# Altium schematic sheet FTDIJtagConversion.SchDoc
size A4; SheetNumber: 4; SheetTotal: 10
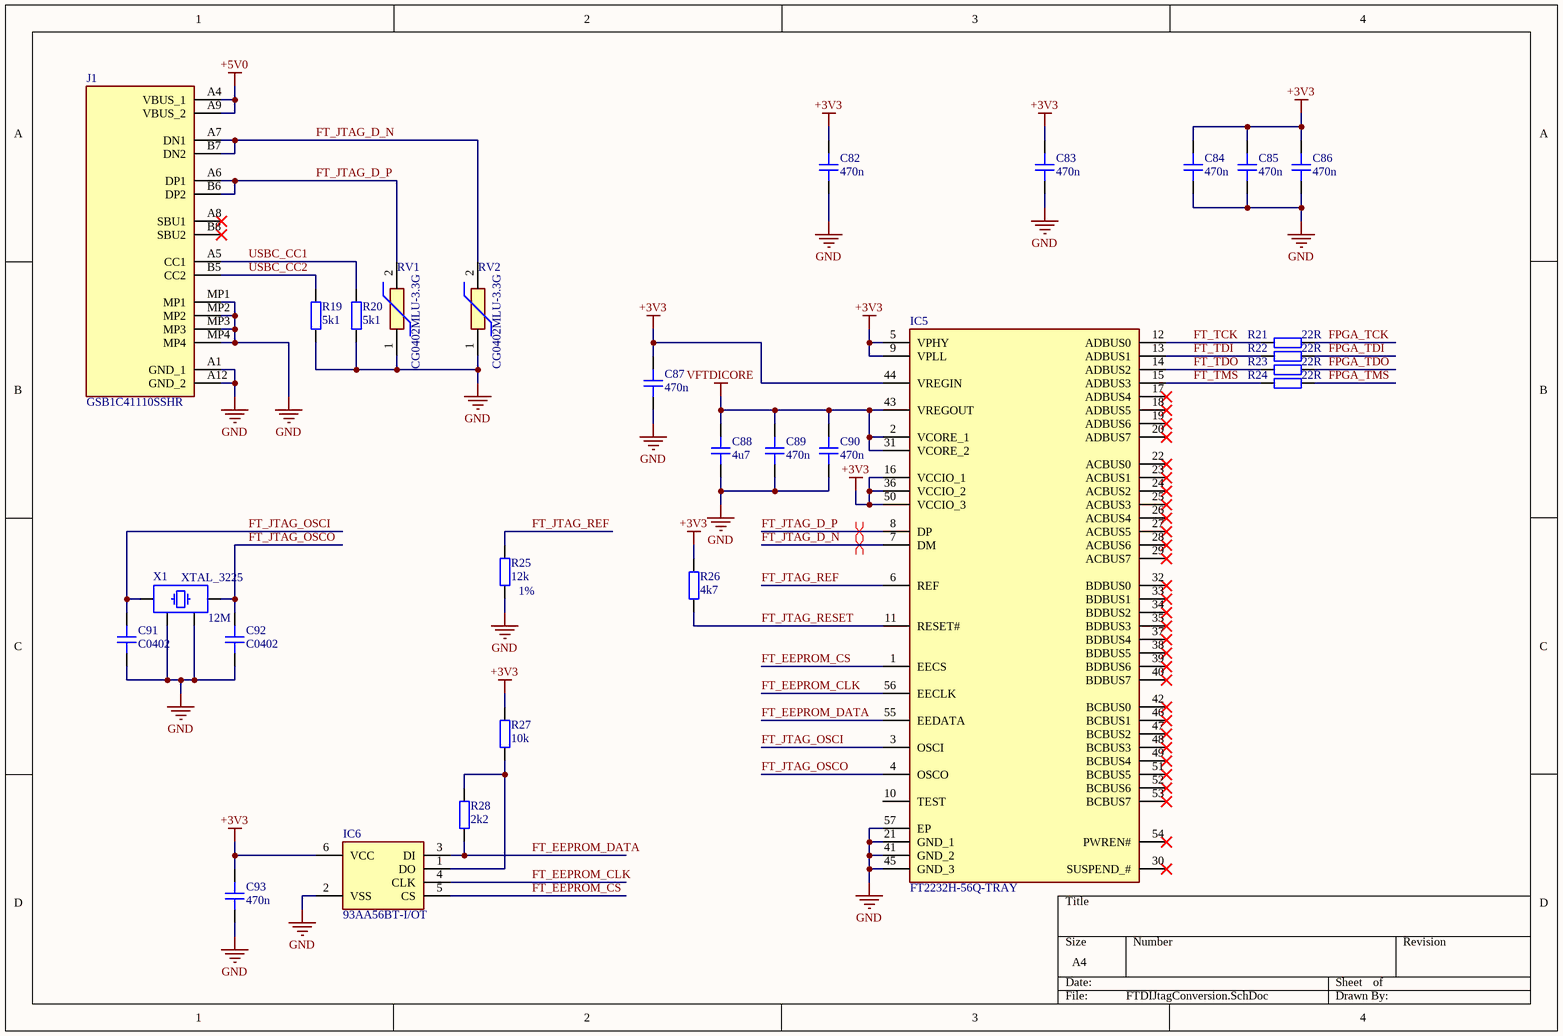
[diagram p0: FTDIJtagConversion.SchDoc]

## Parts
C82  470n  [CAP_0201]
C83  470n  [CAP_0201]
C84  470n  [CAP_0201]
C85  470n  [CAP_0201]
C86  470n  [CAP_0201]
C87  470n  [CAP_0201]
C88  4u7  [CAP_0402]
C89  470n  [CAP_0201]
C90  470n  [CAP_0201]
C91  C0402  [CAP_0402]
C92  C0402  [CAP_0402]
C93  470n  [CAP_0201]
IC5  FT2232H-56Q-TRAY  [QFN50P800X800X100-57N-D]
IC6  93AA56BT-I/OT  [SOT95P270X145-6N]
J1  GSB1C41110SSHR  [GSB1C41110SSHR]
R19  5k1  [RES_0402]
R20  5k1  [RES_0402]
R21  22R  [RES_0201]
R22  22R  [RES_0201]
R23  22R  [RES_0201]
R24  22R  [RES_0201]
R25  12k  [RES_0402]
R26  4k7  [RES_0201]
R27  10k  [RES_0402]
R28  2k2  [RES_0402]
RV1  CG0402MLU-3.3G  [VARC1005X41N]
RV2  CG0402MLU-3.3G  [VARC1005X41N]
X1  XTAL_3225  [XTAL_3225]

## Nets
+3V3: C82.2 C83.2 C84.2 C85.2 C86.2 C87.2 C93.2 IC5.5(VPHY) IC5.9(VPLL) IC5.16(VCCIO_1) IC5.36(VCCIO_2) IC5.44(VREGIN) IC5.50(VCCIO_3) IC6.6(VCC) R26.2 R27.2
+5V0: J1.A4(VBUS_1) J1.A9(VBUS_2)
GND: C82.1 C83.1 C84.1 C85.1 C86.1 C87.1 C88.1 C89.1 C90.1 C91.1 C92.1 C93.1 IC5.21(GND_1) IC5.41(GND_2) IC5.45(GND_3) IC5.57(EP) IC6.2(VSS) J1.A1(GND_1) J1.A12(GND_2) J1.MP1 J1.MP2 J1.MP3 J1.MP4 R19.1 R20.1 R25.1 RV1.1 RV2.1 X1.2 X1.4
VFTDICORE: C88.2 C89.2 C90.2 IC5.2(VCORE_1) IC5.31(VCORE_2) IC5.43(VREGOUT)
FPGA_TCK: R21.1
FPGA_TDI: R22.1
FPGA_TDO: R23.1
FPGA_TMS: R24.1
FT_EEPROM_CLK: IC5.56(EECLK) IC6.4(CLK)
FT_EEPROM_CS: IC5.1(EECS) IC6.5(CS)
FT_EEPROM_DATA: IC5.55(EEDATA) IC6.3(DI) R28.1
FT_JTAG_D_N: IC5.7(DM) J1.A7(DN1) J1.B7(DN2) RV2.2
FT_JTAG_D_P: IC5.8(DP) J1.A6(DP1) J1.B6(DP2) RV1.2
FT_JTAG_OSCI: C91.2 IC5.3(OSCI) X1.1
FT_JTAG_OSCO: C92.2 IC5.4(OSCO) X1.3
FT_JTAG_REF: IC5.6(REF) R25.2
FT_JTAG_RESET: IC5.11(RESET#) R26.1
FT_TCK: IC5.12(ADBUS0) R21.2
FT_TDI: IC5.13(ADBUS1) R22.2
FT_TDO: IC5.14(ADBUS2) R23.2
FT_TMS: IC5.15(ADBUS3) R24.2
USBC_CC1: J1.A5(CC1) R20.2
USBC_CC2: J1.B5(CC2) R19.2
NetIC6_1: IC6.1(DO) R27.1 R28.2

Not connected (* = marked no-connect by the designer): IC5 10(TEST) 17(ADBUS4)* 18(ADBUS5)* 19(ADBUS6)* 20(ADBUS7)* 22(ACBUS0)* 23(ACBUS1)* 24(ACBUS2)* 25(ACBUS3)* 26(ACBUS4)* 27(ACBUS5)* 28(ACBUS6)* 29(ACBUS7)* 30(SUSPEND_#)* 32(BDBUS0)* 33(BDBUS1)* 34(BDBUS2)* 35(BDBUS3)* 37(BDBUS4)* 38(BDBUS5)* 39(BDBUS6)* 40(BDBUS7)* 42(BCBUS0)* 46(BCBUS1)* 47(BCBUS2)* 48(BCBUS3)* 49(BCBUS4)* 51(BCBUS5)* 52(BCBUS6)* 53(BCBUS7)* 54(PWREN#)*; J1 A8(SBU1)* B8(SBU2)*

## Layout directives
differential pair: FT_JTAG_D_N, FT_JTAG_D_P

## Notes on the sheet
- (near X1) 12M
- (near R25) 1%

## Library data of the parts
C82-C87 C89 C90 C93 = CAP_0201: Capacitor SMD 0201; Manufacturer: *; Manufacturer Part Number: *; Distributor Link: *; LCSC: *; Rating: *; Dielectric: *
C88 C91 C92 = CAP_0402: Capacitor SMD 0402; Manufacturer: *; Manufacturer Part Number: *; Distributor Link: *; LCSC: *; Rating: *; Dielectric: *
IC5 = FT2232H-56Q-TRAY: Integrated Circuit; Manufacturer_Name: FTDI Chip; Datasheet Link: https://componentsearchengine.com/Datasheets/1/FT2232H-56Q-TRAY.pdf; Height: 1mm; Manufacturer_Part_Number: FT2232H-56Q-TRAY; Mouser Part Number: 895-FT2232H-56Q-TRAY; Mouser Price/Stock: https://www.mouser.co.uk/ProductDetail/FTDI/FT2232H-56Q-TRAY?qs=u4lROS522ZW4g0YyKZT0kg%3D%3D; Arrow Part Number: FT2232H-56Q-TRAY; Arrow Price/Stock: null?region=nac
IC6 = 93AA56BT-I/OT: EEPROM; Manufacturer_Name: Microchip; Datasheet Link: http://ww1.microchip.com/downloads/en/DeviceDoc/21794G.pdf; Height: 1.45mm; Manufacturer_Part_Number: 93AA56BT-I/OT; Mouser Part Number: 579-93AA56BT-I/OT; Mouser Price/Stock: https://www.mouser.co.uk/ProductDetail/Microchip-Technology/93AA56BT-I-OT?qs=hul3WK2zl4p%252B6%2FsdRU7j4A%3D%3D; Arrow Part Number: 93AA56BT-I/OT; Arrow Price/Stock: https://www.arrow.com/en/products/93aa56bt-iot/microchip-technology
J1 = GSB1C41110SSHR: Connector; Manufacturer_Name: Amphenol Communications Solutions; Datasheet Link: https://cdn.amphenol-cs.com/media/wysiwyg/files/drawing/gsb1c41x10sshr-ax1.pdf; Height: 3.41mm; Manufacturer_Part_Number: GSB1C41110SSHR
R19 R20 R25 R27 R28 = RES_0402: Resistor SMD 0402; Manufacturer: *; Manufacturer Part Number: *; Distributor Link: *; LCSC: *
R21-R24 R26 = RES_0201: Resistor SMD 0201; Manufacturer: *; Manufacturer Part Number: *; Distributor Link: *; LCSC: *
RV1 RV2 = CG0402MLU-3.3G: ESD Diode; Manufacturer_Name: Bourns; Datasheet Link: https://www.bourns.com/docs/Product-Datasheets/MLU.pdf; Height: 0.41mm; Manufacturer_Part_Number: CG0402MLU-3.3G; Mouser Part Number: 652-CG0402MLU-3.3G; Mouser Price/Stock: https://www.mouser.co.uk/ProductDetail/Bourns/CG0402MLU-3.3G?qs=m8myXnDJXpWVM8EQWErxtQ%3D%3D; Arrow Part Number: CG0402MLU-3.3G; Arrow Price/Stock: https://www.arrow.com/en/products/cg0402mlu-3.3g/bourns?utm_currency=USD&region=nac
X1 = XTAL_3225: Crystal SMD 3225; Distributor Link: *